# EAGLE design TwoStepPowerConversionBoard (EAGLE 9.6.2)
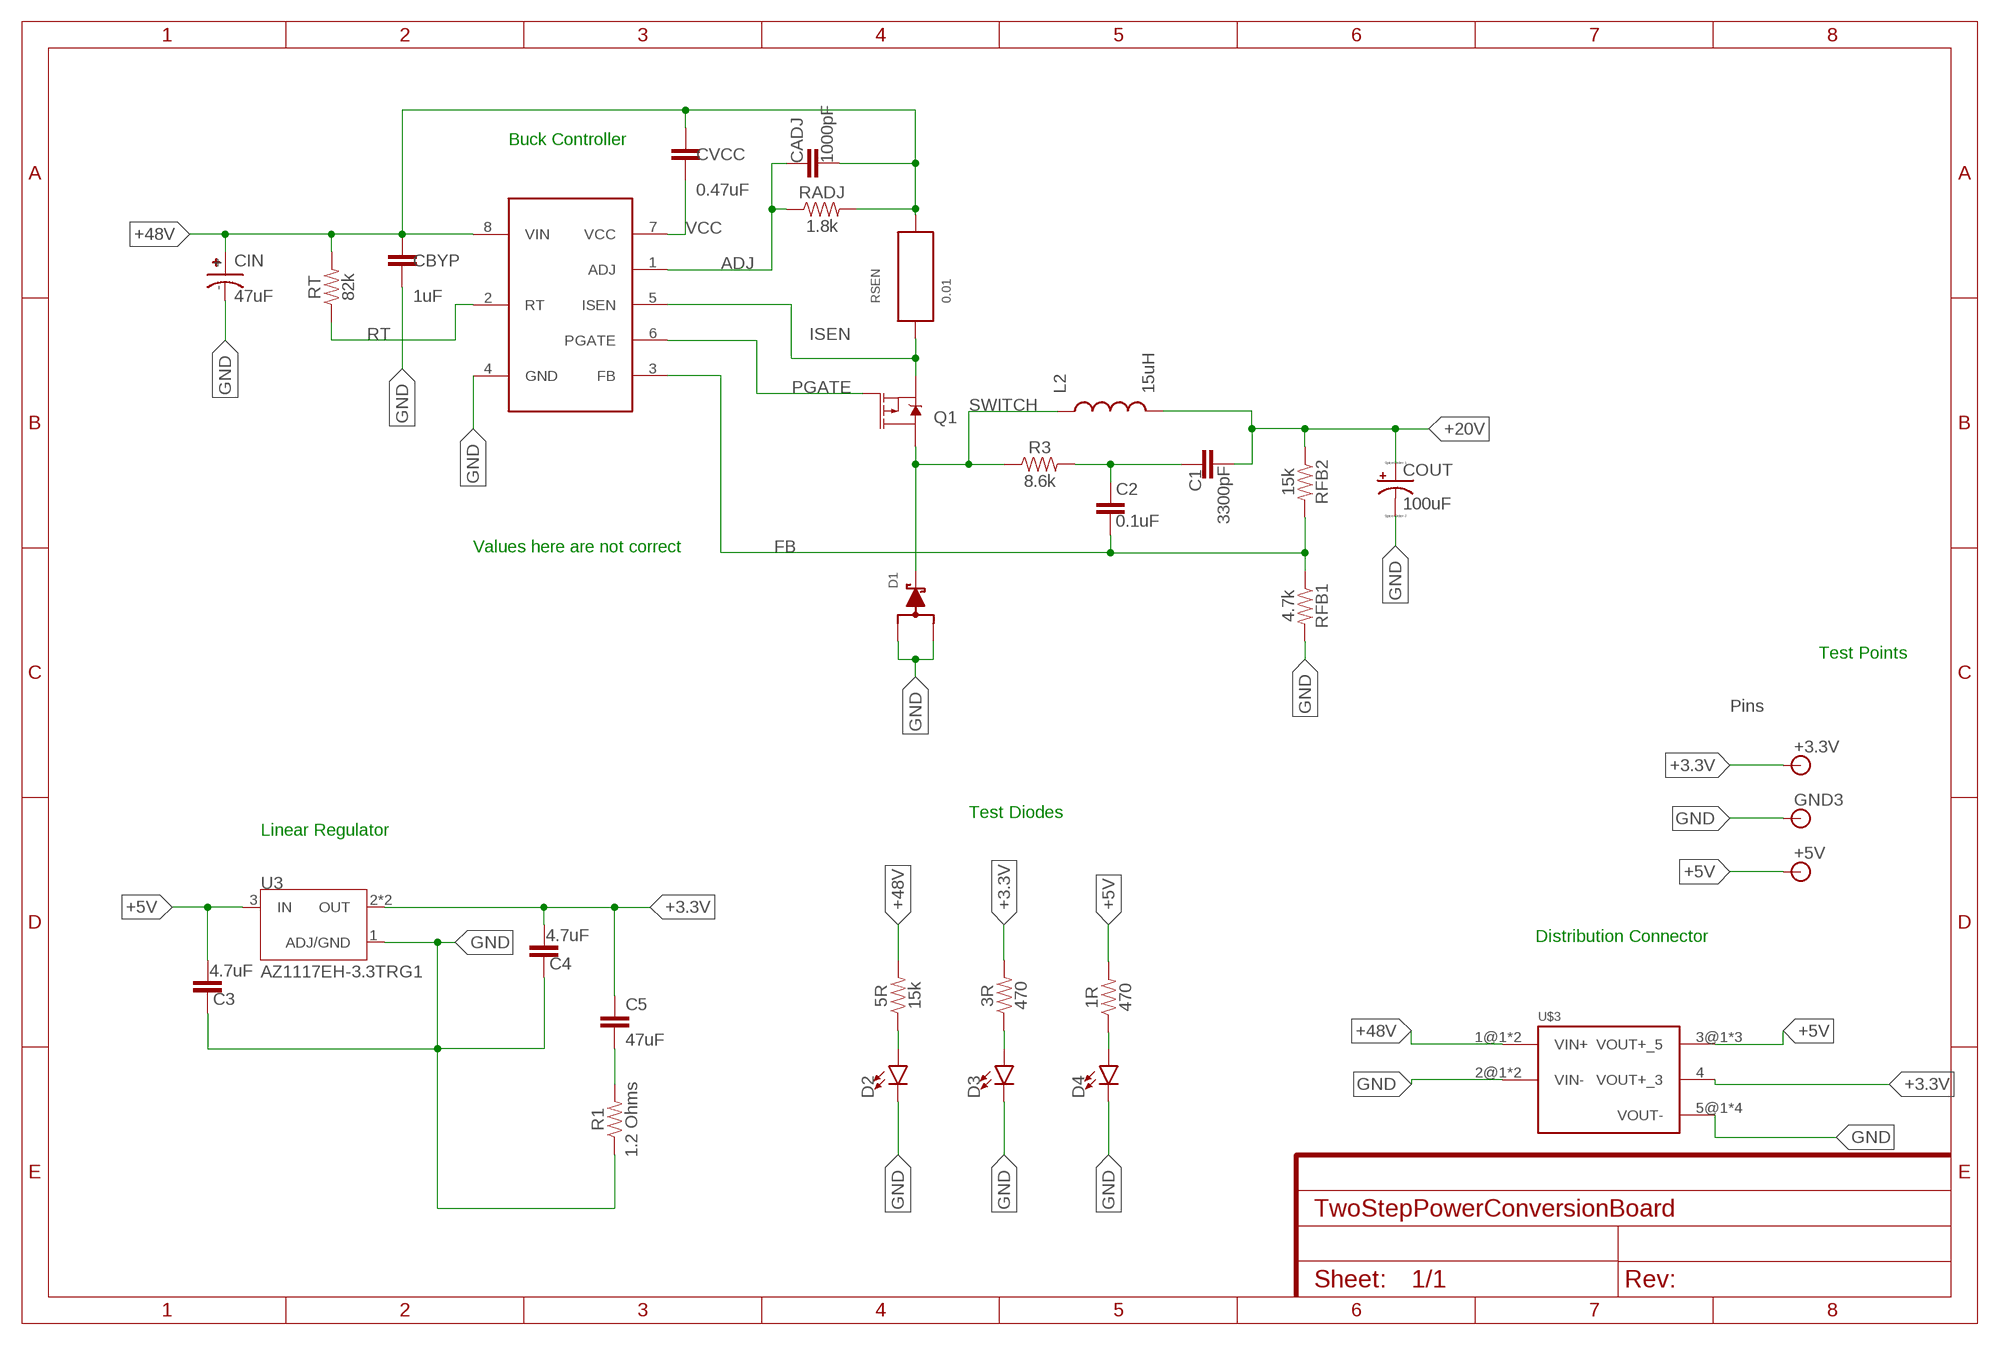
[diagram p0: schematic, sheet 1, part 1 of 2]
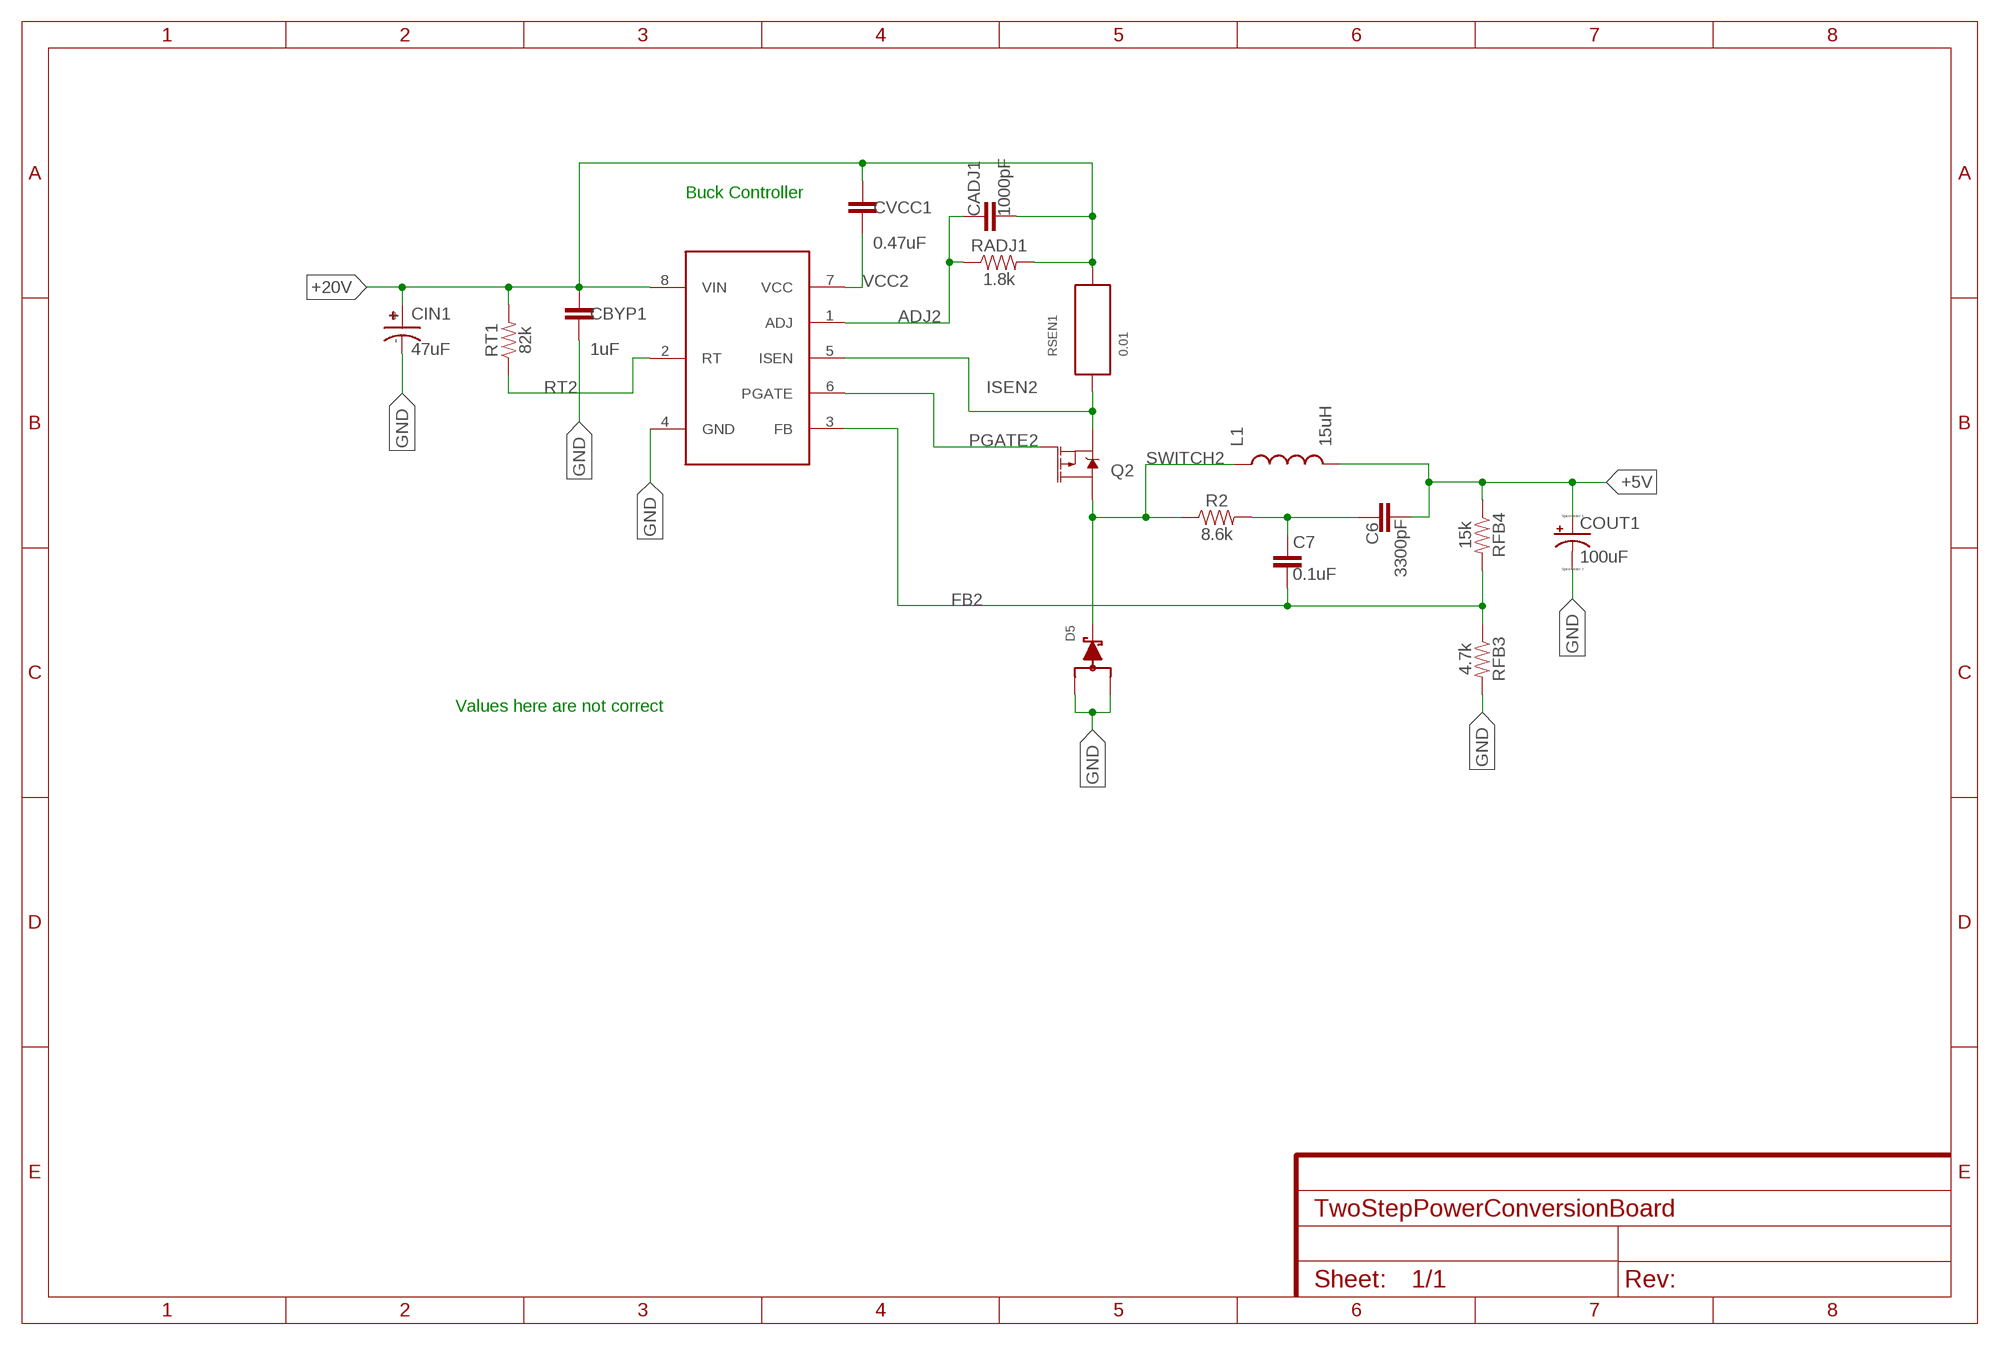
[diagram p1: schematic, sheet 1, part 2 of 2]

## Parts
1R  470  470OHM-0603-1/10W-1%  [0603]
3R  470  470OHM-0603-1/10W-1%  [0603]
5R  15k  470OHM-0603-1/10W-1%  [0603]
+3.3V  BANANA_CONN  [BANANA_CONN]
+5V  BANANA_CONN  [BANANA_CONN]
C1  3300pF  12PF-0603-50V-5%  [0603]
C2  0.1uF  12PF-0603-50V-5%  [0603]
C3  4.7uF  12PF-0603-50V-5%  [0603]
C4  4.7uF  12PF-0603-50V-5%  [0603]
C5  47uF  0.1UF-0603-25V-5%  [0603]
C6  3300pF  12PF-0603-50V-5%  [0603]
C7  0.1uF  12PF-0603-50V-5%  [0603]
CADJ  1000pF  5.6PF-0603-50V-5%  [0603]
CADJ1  1000pF  5.6PF-0603-50V-5%  [0603]
CBYP  1uF  3.3NF-0603-100V-10%  [0603]
CBYP1  1uF  3.3NF-0603-100V-10%  [0603]
CIN  47uF  UCM1H331MNL1GS  [CAPAE1030X1050N]
CIN1  47uF  UCM1H331MNL1GS  [CAPAE1030X1050N]
COUT  100uF  C-TANTALUM(10UF_150UF)  [CTAN(7.30_4.30MM)]
COUT1  100uF  C-TANTALUM(10UF_150UF)  [CTAN(7.30_4.30MM)]
CVCC  0.47uF  5.6PF-0603-50V-5%  [0603]
CVCC1  0.47uF  5.6PF-0603-50V-5%  [0603]
D1  SWITCHMODE_SCHOTTKY  [DPAK-3]
D2  LED0603  [LED-0603]
D3  LED0603  [LED-0603]
D4  LED0603  [LED-0603]
D5  SWITCHMODE_SCHOTTKY  [DPAK-3]
GND3  BANANA_CONN  [BANANA_CONN]
L1  15uH  HCMA1305  [HCMA1305]
L2  15uH  HCMA1305  [HCMA1305]
Q1  MOSFET_PCH-NDS8434  [SO08]
Q2  MOSFET_PCH-NDS8434  [SO08]
R1  1.2 Ohms  1.6KOHM-0603-1/10W-1%  [0603]
R2  8.6k  RESISTOR0603  [0603]
R3  8.6k  RESISTOR0603  [0603]
RADJ  1.8k  RESISTOR0603  [0603]
RADJ1  1.8k  RESISTOR0603  [0603]
RFB1  4.7k  RESISTOR0603  [0603]
RFB2  15k  RESISTOR0603  [0603]
RFB3  4.7k  RESISTOR0603  [0603]
RFB4  15k  RESISTOR0603  [0603]
RSEN  0.01  CSS2H-2512  [CSS2H-2512]
RSEN1  0.01  CSS2H-2512  [CSS2H-2512]
RT  82k  82OHM-0603-1/10W-1%  [0603]
RT1  82k  82OHM-0603-1/10W-1%  [0603]
U3  AZ1117EH-3.3TRG1  [SOT230P700X180-4N]
U$1  LM5085  [LM5085]
U$2  LM5085  [LM5085]
U$3  CON2DIST  [CON2DIST]

## Nets
+3.3V: 3R.2 +3.3V.P$1 C4.1 C5.1 U3.2(OUT) U3.4(OUT) U$3.4(VOUT+_3)
+5V: 1R.2 +5V.P$1 C3.1 C6.1 COUT1.+ L1.2 RFB4.1 U3.3(IN) U$3.3@1(VOUT+_5) U$3.3@2(VOUT+_5) U$3.3@3(VOUT+_5)
+20V: C1.1 CADJ1.2 CBYP1.1 CIN1.+ COUT.+ CVCC1.1 L2.2 RADJ1.2 RFB2.1 RSEN1.2 RT1.2 U$2.8(VIN)
+48V: 5R.2 CADJ.2 CBYP.1 CIN.+ CVCC.1 RADJ.2 RSEN.2 RT.2 U$1.8(VIN) U$3.1@1(VIN+) U$3.1@2(VIN+)
ADJ: CADJ.1 RADJ.1 U$1.1(ADJ)
ADJ2: CADJ1.1 RADJ1.1 U$2.1(ADJ)
FB: C2.2 RFB1.1 RFB2.2 U$1.3(FB)
FB2: C7.2 RFB3.1 RFB4.2 U$2.3(FB)
GND: C3.2 C4.2 CBYP1.2 CBYP.2 CIN1.- CIN.- COUT1.- COUT.- D1.1(A) D1.3(A) D2.C D3.C D4.C D5.1(A) D5.3(A) GND3.P$1 R1.1 RFB1.2 RFB3.2 U3.1(ADJ/GND) U$1.4(GND) U$2.4(GND) U$3.2@1(VIN-) U$3.2@2(VIN-) U$3.5@1(VOUT-) U$3.5@2(VOUT-) U$3.5@3(VOUT-) U$3.5@4(VOUT-)
ISEN: Q1.1(S) Q1.2(S) Q1.3(S) RSEN.1 U$1.5(ISEN)
ISEN2: Q2.1(S) Q2.2(S) Q2.3(S) RSEN1.1 U$2.5(ISEN)
N$1: C6.2 C7.1 R2.2
N$4: 5R.1 D2.A
N$5: 3R.1 D3.A
N$6: 1R.1 D4.A
N$11: C1.2 C2.1 R3.2
N$12: C5.2 R1.2
PGATE: Q1.4(G) U$1.6(PGATE)
PGATE2: Q2.4(G) U$2.6(PGATE)
RT: RT.1 U$1.2(RT)
RT2: RT1.1 U$2.2(RT)
SWITCH: D1.4(C) L2.1 Q1.5(D) Q1.6(D) Q1.7(D) Q1.8(D) R3.1
SWITCH2: D5.4(C) L1.1 Q2.5(D) Q2.6(D) Q2.7(D) Q2.8(D) R2.1
VCC: CVCC.2 U$1.7(VCC)
VCC2: CVCC1.2 U$2.7(VCC)

## Notes on the sheet
- Buck Controller
- Buck Controller
- Values here are not correct
- Test Points
- Pins | Values here are not correct
- Test Diodes
- Linear Regulator
- Distribution Connector

## Library data of the parts
1R 3R = SparkFun-Resistors:470OHM: 470Ω resistor A resistor is a passive two-terminal electrical component that implements electrical resistance as a circuit element. Resistors act to reduce current flow, and, at the same time, act to lower voltage levels within circuits. - Wikipedia; PROD_ID: RES-07869
5R = SparkFun-Resistors:470OHM: 470Ω resistor A resistor is a passive two-terminal electrical component that implements electrical resistance as a circuit element. Resistors act to reduce current flow, and, at the same time, act to lower voltage levels within circuits. - Wikipedia; PROD_ID: RES-07869; VALUE: 470
+3.3V +5V GND3 = SparkFun-Connectors:BANANA_CONN: Through-hole Banana Jack Basic PTH connection for banana jack plugs SparkFun Products: Multimeter Kit <https://www.sparkfun.com/products/retired/10956> Banana to Alligator Cable <https://www.sparkfun.com/products/retired/509> Banana to Alligator Coax Cable <https://www.sparkfun.com/products/retired/508> Banana to Banana Cable <https://www.sparkfun.com/products/retired/507> Banana to IC Hook Cables <https://www.sparkfun.com/products/retired/506>
C1-C4 C6 C7 = SparkFun-Capacitors:12PF: 12pF ceramic capacitors A capacitor is a passive two-terminal electrical component used to store electrical energy temporarily in an electric field.; PROD_ID: CAP-09137; VALUE: 12pF
C5 = SparkFun-Capacitors:0.1UF: 0.1µF ceramic capacitors A capacitor is a passive two-terminal electrical component used to store electrical energy temporarily in an electric field.; PROD_ID: CAP-08604; VALUE: 0.1uF
CADJ CADJ1 CVCC CVCC1 = SparkFun-Capacitors:5.6PF: 5.6pF ceramic capacitors A capacitor is a passive two-terminal electrical component used to store electrical energy temporarily in an electric field.; PROD_ID: CAP-12456; VALUE: 5.6PF
CBYP CBYP1 = SparkFun-Capacitors:3.3NF: 3.3nF ceramic capacitors A capacitor is a passive two-terminal electrical component used to store electrical energy temporarily in an electric field.; PROD_ID: CAP-09633; VALUE: 3.3nF
CIN CIN1 = brick-capacitor-UCM1H331MNL1GS:UCM1H331MNL1GS: Nichicon 330uF 50 V Aluminium Electrolytic Capacitor SMD, CM Series 2000h 10 (Dia.) x 10mm Source: Datasheet <http://www.nichicon.co.jp/english/products/pdfs/e-ucm.pdf>; ARROW_PART_NUMBER: UCM1H331MNL1GS; ARROW_PRICE-STOCK: https://www.arrow.com/en/products/ucm1h331mnl1gs/nichicon; DESCRIPTION: Nichicon 330uF 50 V Aluminium Electrolytic Capacitor SMD, CM Series 2000h 10 (Dia.) x 10mm; HEIGHT: 10.5mm; MANUFACTURER_NAME: Nichicon; MANUFACTURER_PART_NUMBER: UCM1H331MNL1GS; MOUSER_PART_NUMBER: 647-UCM1H331MNL1GS; MOUSER_PRICE-STOCK: https://www.mouser.co.uk/ProductDetail/Nichicon/UCM1H331MNL1GS?qs=DSgADHjnLTkTovFLdbC%252BNg%3D%3D; VALUE: 330uF
COUT COUT1 = PowerComponents:C-TANTALUM(10UF_150UF)
D1 D5 = Schottky Diode 8A - MBRD835LT4G:SWITCHMODE_SCHOTTKY: {Digi-Key Part Number: MBRD835LT4GOSCT-ND} {Voltage - DC Reverse (Vr) (Max): 35V} {Current - Average Rectified (Io): 8A} {Voltage - Forward (Vf) (Max) @ If: 510mV @ 8A} {Speed: Fast Recovery =< 500ns, > 200mA (Io)} {Current - Reverse Leakage @ Vr: 1.4mA @ 35V} {Mounting Type: Surface Mount} {Package / Case: TO-252-3, DPak (2 Leads + Tab), SC-63} {Supplier Device Package: DPAK-3} {Operating Temperature - Junction: -65°C ~ 150°C}
D2-D4 = SparkFun-LED:LED: LED (Generic) Standard schematic elements and footprints for 5mm, 3mm, 1206, and 0603 sized LEDs. Generic LEDs with no color specified.
L1 L2 = Inductor_15uH - hcma1305:HCMA1305: Eaton HCMA1305-150-R Inductor
Q1 Q2 = SparkFun-DiscreteSemi:MOSFET_PCH: P-channel MOSFETs Voltage controlled devices that allow control of high current outputs. SparkFun Products: SparkFun ESP32 Thing <https://www.sparkfun.com/products/13907> SparkFun ESP8266 Thing <https://www.sparkfun.com/products/13231>; PROD_ID: TRANS-08355; VALUE: 6.5A/20V/35mΩ
R1 = SparkFun-Resistors:1.6KOHM: 1.6kΩ resistor A resistor is a passive two-terminal electrical component that implements electrical resistance as a circuit element. Resistors act to reduce current flow, and, at the same time, act to lower voltage levels within circuits. - Wikipedia; PROD_ID: RES-08361; VALUE: 1.6k
R2 R3 RADJ RADJ1 RFB1-RFB4 = SparkFun-Resistors:RESISTOR: Generic Resistor Package
RSEN RSEN1 = INA4181A4:CSS2H-2512
RT RT1 = SparkFun-Resistors:82OHM: 82Ω resistor A resistor is a passive two-terminal electrical component that implements electrical resistance as a circuit element. Resistors act to reduce current flow, and, at the same time, act to lower voltage levels within circuits. - Wikipedia; PROD_ID: RES-12311; VALUE: 82
U3 = Linear Regulator - AZ1117EH-3.3TRG1:AZ1117EH-3.3TRG1: Ldo.Vreg Pos 3, 3v 1a Sot223; AVAILABILITY: Unavailable; DESCRIPTION: Ldo.Vreg Pos 3, 3v 1a Sot223; MF: Diodes Inc.; MP: AZ1117EH-3.3TRG1; PACKAGE: SOT-223 Diodes Inc.; PRICE: None
U$1 U$2 = Buck_Controller:LM5085
U$3 = Dist_Convert_Connector:CON2DIST

## Board
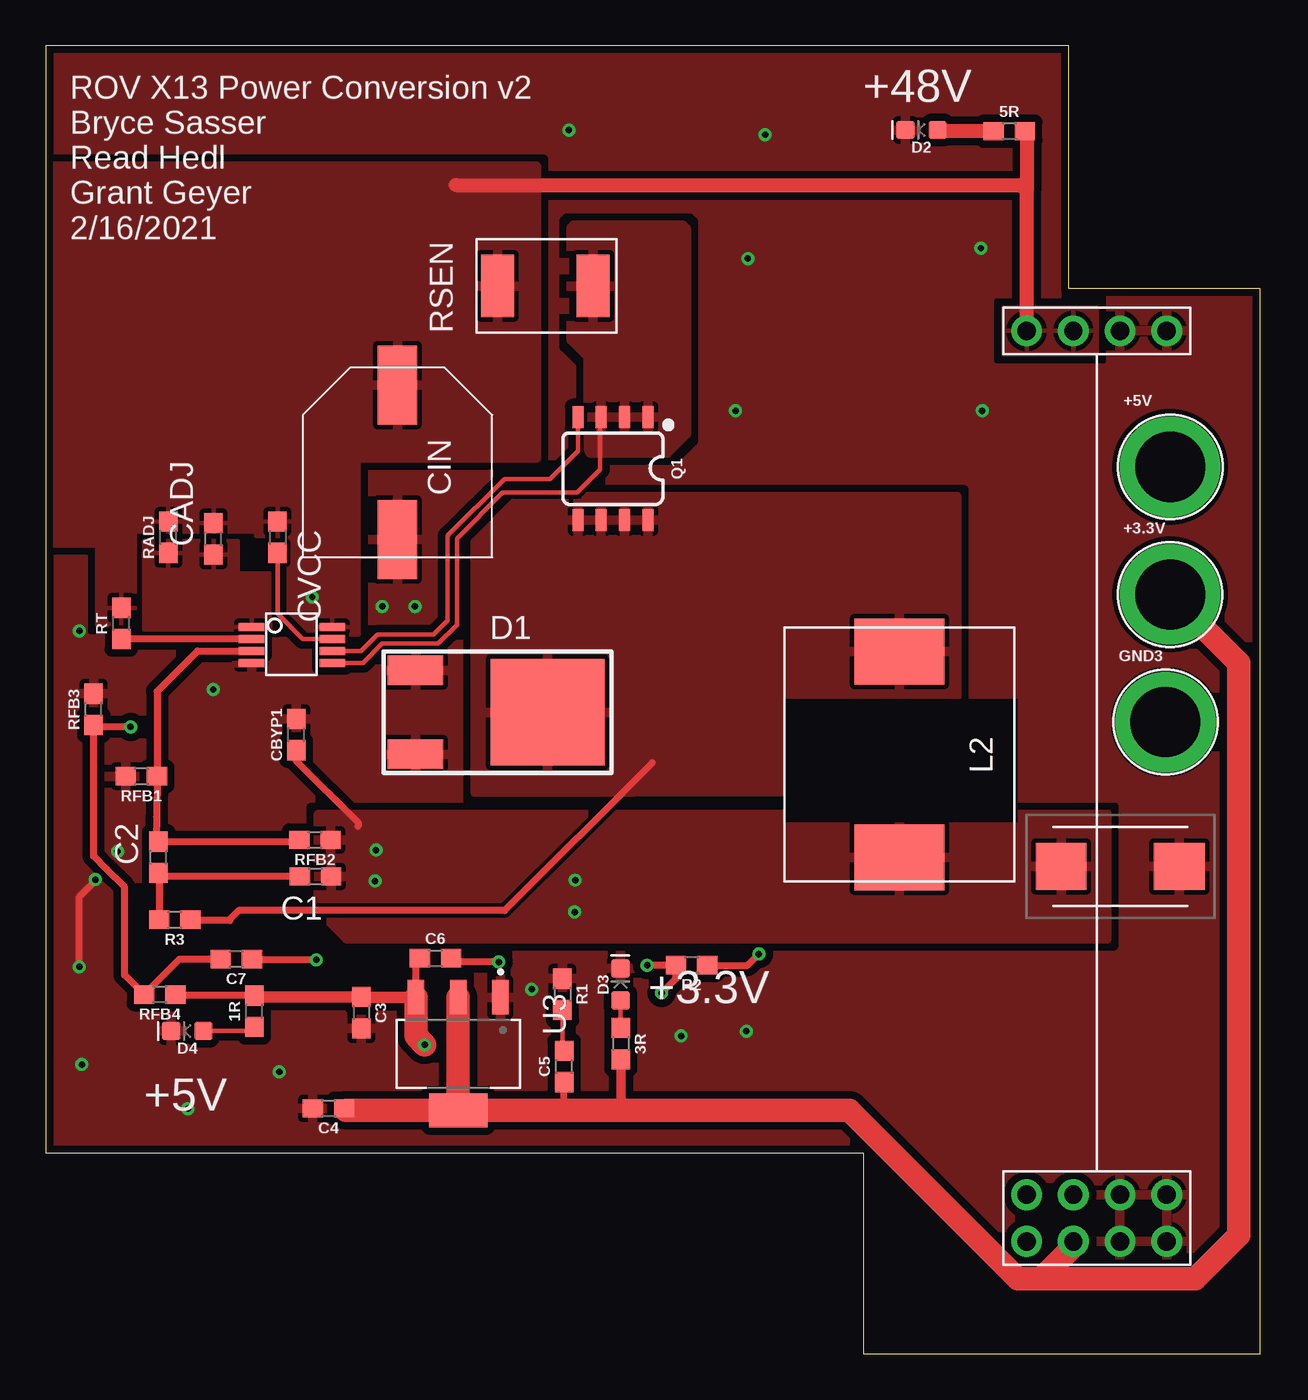
[diagram p2: board, top side]
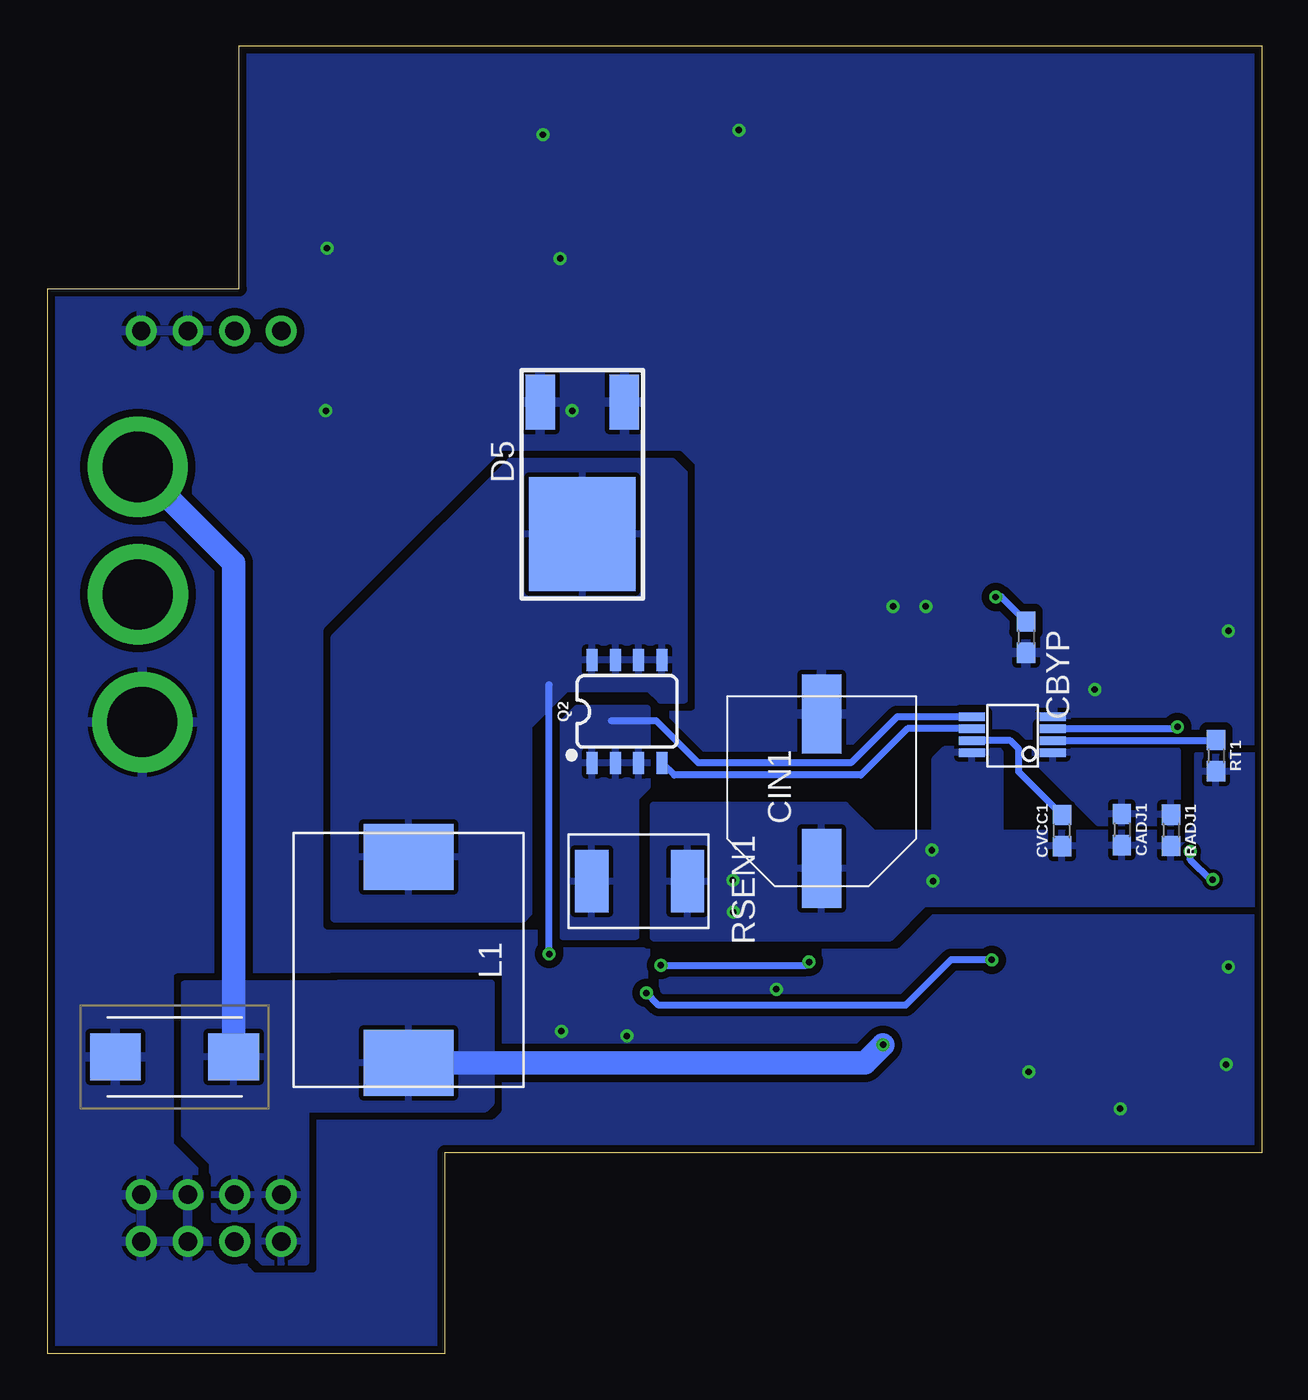
[diagram p3: board, bottom side, seen from below]

Size 66.04 x 71.12 mm. Coordinates in mm from the lower left corner, seen from the top.
Outline: 0,10.92 44.45,10.92 44.45,0 66.04,0 66.04,57.91 55.63,57.91 55.63,71.12 0,71.12 0,10.92
Copper layers (1*16): Top 0.0356mm / dielectric 1.5011mm / Bottom 0.0356mm
Design rules "ECE_Senior_Design": minimum track width 8mil, minimum drill 13mil, track to track 8mil, track to pad 8mil, pad to pad 6mil, via to via 8mil, smd to smd 6mil, copper to edge 15mil, drill to drill 8mil, minimum pad ring 7mil, minimum via ring 7mil, stop-mask expansion 3mil, vias tented up to drill 0mil, thermal gap 10mil

### Footprints (pad centres in the part's own frame; a part is rotated, then mirrored left to right if it is on the bottom)
0603 = smd 1.1 x 1: 1 -0.85,0; 2 0.85,0
BANANA_CONN = drill 3.81 pad 5.461: P$1 0,0
CAPAE1030X1050N = smd 4.3 x 2.15: + -4.2,0; - 4.2,0
CTAN(7.30_4.30MM) = smd 2.77 x 2.55: + -3.22,0; - 3.22,0
DPAK-3 = smd 3 x 1.6: 1 -4.35,2.015; 3 -4.35,-2.555 | smd 6.2 x 5.8: 4 2.83,-0.27
LED-0603 = smd 1 x 1: A -0.877,0; C 0.877,0
HCMA1305 = smd 3.6 x 4.9: 1 -5.6,0; 2 5.6,0
SO08 = smd 0.6 x 1.2: 1 -1.905,-2.8; 2 -0.635,-2.8; 3 0.635,-2.8; 4 1.905,-2.8; 5 1.905,2.8; 6 0.635,2.8; 7 -0.635,2.8; 8 -1.905,2.8
CSS2H-2512 = smd 3.4 x 1.8: 1 0,0; 2 0,5.2
SOT230P700X180-4N = smd 1.86 x 0.9: 1 -3.075,2.3; 2 -3.075,0; 3 -3.075,-2.3 | smd 1.86 x 3.19: 4 3.075,0
LM5085 = smd 1.4 x 0.45: 1 0,1.95; 2 0,1.3; 3 0,0.65; 4 0,0; 5 4.4,0; 6 4.4,0.65; 7 4.4,1.3; 8 4.4,1.95
CON2DIST = drill 1 pad 1.676: 1@1 -3.81,22.86; 1@2 -1.27,22.86; 2@1 1.27,22.86; 2@2 3.81,22.86; 3@1 -3.81,-26.67; 3@2 -3.81,-24.13; 3@3 -1.27,-24.13; 4 -1.27,-26.67; 5@1 1.27,-26.67; 5@2 1.27,-24.13; 5@3 3.81,-26.67; 5@4 3.81,-24.13

### Placement (x,y rotation side)
1R  11.33,18.62 90 top
3R  31.26,16.86 270 top
5R  52.4,66.48 0 top
+3.3V  61.15,41.29 0 top
+5V  61.15,48.23 0 top
C1  14.66,25.95 180 top
C2  6.13,26.99 90 top
C3  17.15,18.54 270 top
C4  15.37,13.34 180 top
C5  28.18,15.62 90 top
C6  21.18,21.5 0 top
C7  10.35,21.45 180 top
CADJ  9.12,44.31 90 top
CADJ1  7.62,28.5 270 bottom
CBYP  12.84,38.97 270 bottom
CBYP1  13.61,33.66 90 top
CIN  19.12,48.47 270 top
CIN1  23.95,30.59 90 bottom
COUT  58.44,26.48 0 top
COUT1  59.14,16.14 180 bottom
CVCC  12.59,44.4 270 top
CVCC1  10.88,28.45 90 bottom
D1  24.44,35.14 0 top
D2  47.62,66.55 180 top
D3  31.25,20.08 90 top
D4  7.69,17.54 180 top
D5  36.7,47.41 270 bottom
GND3  60.89,34.34 0 top
L1  46.41,21.41 270 bottom
L2  46.43,32.58 270 top
Q1  30.84,48.13 180 top
Q2  34.53,34.93 0 bottom
R1  28.09,19.55 270 top
R2  35.12,21.12 180 top
R3  7.01,23.59 180 top
RADJ  6.65,44.4 90 top
RADJ1  4.95,28.46 270 bottom
RFB1  5.19,31.4 180 top
RFB2  14.64,27.94 180 top
RFB3  2.59,35.04 90 top
RFB4  6.19,19.53 180 top
RSEN  29.76,58.07 90 top
RSEN1  36.45,25.68 270 bottom
RT  4.1,39.71 90 top
RT1  2.5,32.52 270 bottom
U3  22.42,16.31 270 top
U$1  11.18,37.56 0 top
U$2  11.38,34.64 180 bottom
U$3  57.15,32.77 0 top

### Tracks (layer width: path | path; a pad name or v marks a point on that pad's centre or on a via)
+3.3V
  Top 0.381: 28.19,13.23 28.18,13.24 C5.1 | 31.27,13.46 31.5,13.23
  Top 0.508: 3R.2 31.27,13.46
  Top 0.889: 16.32,13.23 C4.1
  Top 1.27: U3.4 16.32,13.23 | U3.2 U3.4 | U3.4 28.19,13.23 31.5,13.23 43.7,13.23 52.87,4.06 54.12,4.06 | 54.12,4.06 55.88,5.82 U$3.4 | +3.3V.P$1 64.87,37.56 64.87,6.43 62.5,4.06 54.12,4.06
+5V  (via drill 0.35)
  Top 0.381: C3.1 | 11.4,19.39 1R.2 7.1,19.47 RFB4.1 | U3.3 20.12,21.29 C6.1
  Top 0.635: U3.3 C3.1 | C3.1 11.4,19.39
  Top 1.27: U3.3 20.12,17.27 v20.6,16.79
  Bottom 1.27: +5V.P$1 55.92,43 COUT1.+ | v20.6,16.79 21.59,15.81 L1.2
  pour Bottom: 58.62,20.1 58.62,11.9 57.09,10.36 57.09,9.87 56.99,9.76 56.99,7.31 54.63,7.31 54.6,7.34 54.6,5.24 54.42,5.06 54.35,4.99 52,4.99 52,13.25 51.93,13.32 42.24,13.32 41.91,13.64 41.91,20.14 41.94,20.17
+20V  (via drill 0.35)
  Top 0.381: CBYP1.1 13.61,32.24 16.97,28.89 16.97,28.68
  other vias: 17.95,27.38 17.89,25.69 28.78,25.75 28.75,24.01
  pour Top: 14.8,23.99 14.8,29.33 57.67,29.33 57.7,29.36 57.7,22.56 16.36,22.56 14.85,24.06 14.82,24.06
  pour Bottom: 0.34,32.51 3.48,32.51 3.53,32.55 3.53,28.7 3.94,28.29 21.11,28.29 22.65,29.82 33.12,29.82 33.12,22.62 20.22,22.62 18.35,24.49 0.15,24.49 0.12,24.52
  pour Bottom: 13.72,27.05 14.23,27.56 14.23,32.71 14.38,32.85 17.27,32.85 17.81,32.31 17.81,26.84
+48V  (via drill 0.35)
  Top 0.762: 5R.2 53.34,66.39 53.34,63.25 | U$3.1@1 53.34,63.25 | 53.34,63.25 53.03,63.55 22.3,63.55
  Bottom 0.381: CBYP.1 14.17,41.15 v14.48,41.15
  pour Top: 0.46,53.68 0.46,64.57 26.7,64.57 26.7,48.72 4.69,48.72 3.27,50.14 3.27,53.19
  pour Top: 0.25,55.37 0.25,43.94 2.79,43.94 2.79,39.62 4.83,39.62 4.83,44.7 13.46,44.7 13.46,54.86
  pour Top: 17.02,39.12 14.48,39.12 13.21,40.39 13.21,44.45 11.43,44.45 11.43,49.78 17.02,49.78
  pour Top: 52.07,56.9 52.07,54.36 57.15,54.36 57.15,56.9
ADJ
  pour Top: 5.33,44.2 5.33,39.37 12.19,39.37 12.19,42.42 10.41,42.42 10.41,44.2
ADJ2
  pour Bottom: 12.35,33.02 12.35,32.32 8.92,28.88 4.58,28.88 4.58,32.8 10.27,32.8 10.29,32.82
FB
  Top 0.254: 6,27.97 C2.2
  Top 0.381: 6,27.97 6.01,29.21 RFB1.1 6.04,36.01 8.24,38.21 U$1.3 | C2.2 13.69,27.84 RFB2.2
FB2  (via drill 0.35)
  Top 0.381: v4.6,34.08 2.7,34.08 RFB3.1 2.59,27.06 3.31,26.34 4.28,25.37 4.28,20.59 RFB4.2 7.26,21.45 C7.2
  Bottom 0.381: U$2.3 4.7,33.98 v4.6,34.08
GND  (via drill 0.35)
  Top 0.381: v1.82,21.03 1.82,24.84 2.68,25.7 v2.68,25.78
  Bottom 0.381: v2.68,25.78 2.81,25.78 3.89,26.85 v3.89,27.31
  other vias: 38.18,59.56 50.85,60.12 37.52,51.28 50.93,51.28 39.12,66.29 28.45,66.55 18.29,40.64 20.07,40.64 34.54,17.27 38.1,17.53 1.95,15.72 1.82,39.31 26.42,19.81 7.71,13.32 12.69,15.32 9.09,36.12
  pour Top (isolate 0.406, rank 6): -0.51,-0.92 -0.51,71.4 66.64,71.4 66.64,-0.92
  pour Bottom (isolate 0.406, rank 6): -0.48,-0.57 -0.48,71.43 66.89,71.43 66.89,-0.57
  pour Top: 10.22,37.81 11.99,37.81 12,37.8 12,36.99 11.94,36.93 10.23,36.93 10.2,36.9
  pour Bottom: 12.36,34.3 10.53,34.3 10.44,34.38 10.44,35 11.36,35.92 12.34,35.92
ISEN
  Top 0.254: U$1.5 17.24,37.56 18.29,38.61 21.34,38.61 22.35,39.62 22.35,44.34 24.84,46.83 28.88,46.83 30.14,48.09 30.14,50.87 Q1.3
  pour Top: 29.49,49.3 29.49,54.19 28.57,55.11 28.57,61.23 28.71,61.37 34.66,61.37 34.84,61.18 34.84,50.02 33.81,48.98 29.59,48.98
ISEN2
  Bottom 0.381: U$2.5 19.85,34.63 22.36,32.13 30.65,32.13 32.94,34.41 35.39,34.41
  pour Bottom: 34.05,22.7 34.05,30.22 33.43,30.84 33.43,35.09 37.28,35.09 38.03,34.34 38.03,22.67
N$1  (via drill 0.35)
  Top 0.381: C7.1 14.67,21.45 v14.7,21.42 | v33.49,19.61 34.27,20.39 R2.2 v32.7,21.12 | v24.63,21.3 22.24,21.3 C6.2
  Bottom 0.381: v14.7,21.42 16.91,21.42 19.38,18.94 32.82,18.94 v33.49,19.61 | v32.7,21.12 24.8,21.12 v24.63,21.3
N$4
  Top 0.254: 48.52,66.53 D2.A
  Top 0.762: 5R.1 48.57,66.48 48.52,66.53
N$5
  Top 0.254: 3R.1 D3.A
N$6
  Top 0.254: D4.A 11.11,17.54 1R.1
N$11
  Top 0.254: 6.16,26.11 C2.1 6.32,25.95
  Top 0.381: 6.16,26.11 R3.2 | C1.2 6.32,25.95
N$12
  Top 0.254: C5.2 28.09,16.56 R1.2
PGATE
  Top 0.254: Q1.4 28.93,49.08 27.43,47.58 24.94,47.58 21.84,44.48 21.84,39.88 21.08,39.12 18.03,39.12 17.13,38.21 U$1.6
PGATE2
  Bottom 0.381: U$2.6 19.28,33.98 21.81,31.45 31.95,31.45 Q2.4
RT
  Top 0.254: RT.1
  Top 0.381: U$1.2 RT.1
RT2
  Bottom 0.381: U$2.2 2.54,33.34 RT1.1
SWITCH
  Top 0.254: 9.97,23.59 10,23.55
  Top 0.381: R3.1 9.97,23.59 10,23.55 | 32.99,32.13 24.96,24.09 10.48,24.09 9.97,23.59
  pour Top: 23.35,30.52 23.35,44.15 25.8,46.6 49.54,46.6 49.54,30.59
SWITCH2  (via drill 0.35)
  Top 0.381: R2.1 38.16,21.12 v38.77,21.73
  Bottom 0.381: v38.77,21.73 38.77,36.36 38.78,36.37
  pour Bottom: 31.4,35.56 31.4,47.88 32.04,48.52 40.9,48.52 47.76,41.67 50.49,38.94 50.49,23.65 40.17,23.65 39.86,23.97 39.86,34.14 37.82,36.18 33.36,36.18 32.72,35.54
VCC
  Top 0.254: U$1.7 13.97,38.86 12.59,40.24 CVCC.2
VCC2
  Bottom 0.381: CVCC1.2 13.23,31.64 13.23,32.88 13.69,33.34 U$2.7
X
  cutout Top: 52.79,28.96 40.26,28.96 40.26,35.56 52.79,35.56

### Text on the board
tNames: +48V | ROV X13 Power Conversion v2 / Bryce Sasser / Read Hedl / Grant Geyer / 2/16/2021 | +3.3V | +5V